# Altium project DesignProject.PrjPCB
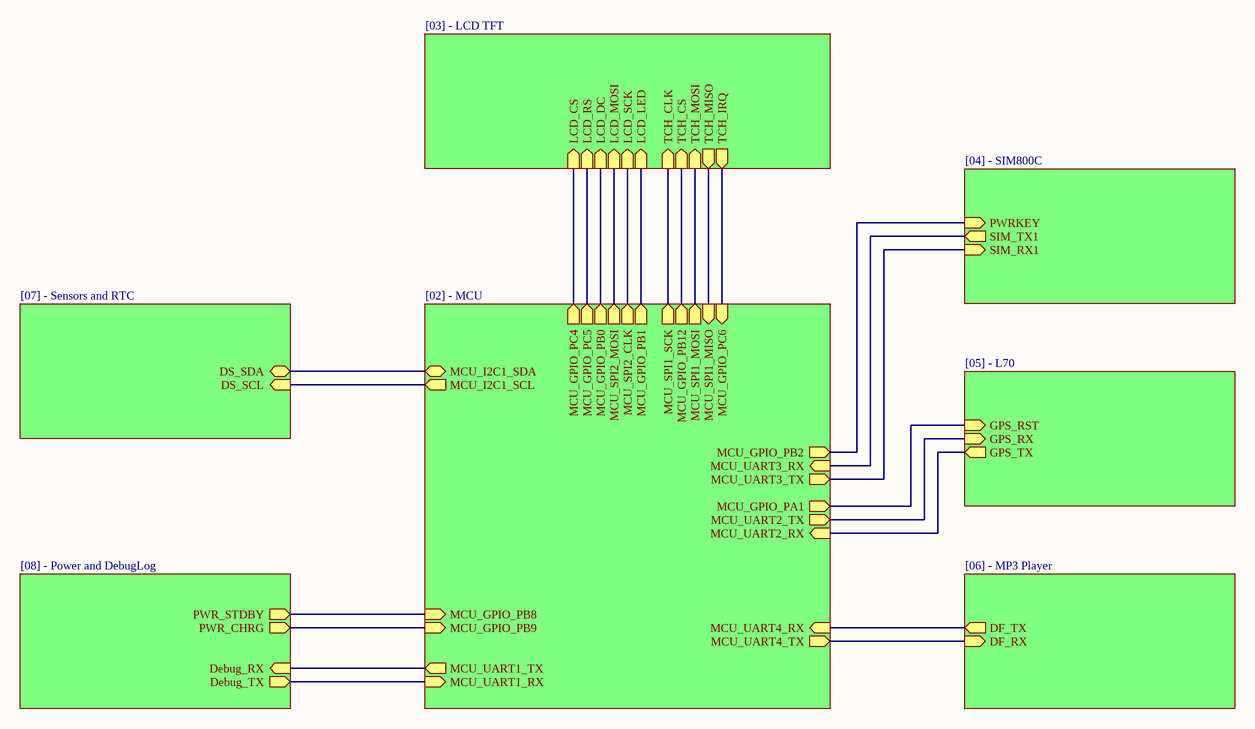
[diagram p0: [01] - Sheet Connection.SchDoc]
6 sheets, 97 parts. Net scope: hierarchical (ports join the sheet entries above them; power ports are global).
Board files: DesignProject.PcbDoc, DesignProject_V1_0.PcbDoc, DesignProject_V1_1.PcbDoc
Sheets:
  [01] - Sheet Connection.SchDoc
    01 = [02] - MCU.SchDoc
    03 = [04] - SIM800C.SchDoc
    04 = [05] - L70.SchDoc
    05 = [06] - MP3 Player.SchDoc
    07 = [08] - Power and DebugLog.SchDoc

## Sheet [01] - Sheet Connection.SchDoc: =ProjectName
size A4; CheckedBy: Ven; Author: Ven; CompanyName: HUST; Revision: V.1.0

### Sub-sheets
01 = [02] - MCU: MCU_UART2_RX (in), MCU_SPI1_SCK (out), MCU_UART1_RX (in), MCU_UART3_TX (out), MCU_SPI2_CLK (out), MCU_I2C1_SDA (bidir), MCU_UART3_RX (in), MCU_GPIO_PB0 (out), MCU_GPIO_PB1 (out), MCU_UART1_TX (out), MCU_GPIO_PC5 (out), MCU_SPI1_MOSI (out), MCU_UART2_TX (out), MCU_GPIO_PC4 (out), MCU_GPIO_PB2 (out), MCU_I2C1_SCL (out), MCU_SPI2_MOSI (out), MCU_SPI1_MISO (in), MCU_UART4_TX (out), MCU_UART4_RX (in), MCU_GPIO_PA1 (out), MCU_GPIO_PB12 (out), MCU_GPIO_PC6 (in), MCU_GPIO_PB8 (in), MCU_GPIO_PB9 (in)
02 = [03] - LCD TFT (file not in this document): LCD_LED (in), TCH_CS (in), LCD_CS (in), TCH_IRQ (out), TCH_MISO (out), LCD_SCK (in), LCD_RS (in), TCH_CLK (in), LCD_DC (in), LCD_MOSI (in), TCH_MOSI (in)
03 = [04] - SIM800C: SIM_TX1 (out), PWRKEY (in), SIM_RX1 (in)
04 = [05] - L70: GPS_RST (in), GPS_RX (in), GPS_TX (out)
05 = [06] - MP3 Player: DF_TX (out), DF_RX (in)
06 = [07] - Sensors and RTC (file not in this document): DS_SDA (bidir), DS_SCL (in)
07 = [08] - Power and DebugLog: Debug_RX (in), Debug_TX (out), PWR_STDBY (out), PWR_CHRG (out)

### Nets
CLK2: sheet 01/MCU_SPI2_CLK, sheet 02/LCD_SCK
GPS_RX1: sheet 01/MCU_UART2_TX, sheet 04/GPS_RX
GPS_TX1: sheet 01/MCU_UART2_RX, sheet 04/GPS_TX
MISO1: sheet 01/MCU_SPI1_MISO, sheet 02/TCH_MISO
MOSI1: sheet 01/MCU_SPI1_MOSI, sheet 02/TCH_MOSI
MOSI2: sheet 01/MCU_SPI2_MOSI, sheet 02/LCD_MOSI
MP3_RX: sheet 01/MCU_UART4_TX, sheet 05/DF_RX
MP3_TX: sheet 01/MCU_UART4_RX, sheet 05/DF_TX
RX1: sheet 01/MCU_UART1_RX, sheet 07/Debug_TX
RX3: sheet 01/MCU_UART3_RX, sheet 03/SIM_TX1
SCK1: sheet 01/MCU_SPI1_SCK, sheet 02/TCH_CLK
SCL1: sheet 01/MCU_I2C1_SCL, sheet 06/DS_SCL
SDA1: sheet 01/MCU_I2C1_SDA, sheet 06/DS_SDA
TX1: sheet 01/MCU_UART1_TX, sheet 07/Debug_RX
TX3: sheet 01/MCU_UART3_TX, sheet 03/SIM_RX1
NetR10_1: sheet 01/MCU_GPIO_PB2, sheet 03/PWRKEY
NetR21_1: sheet 01/MCU_GPIO_PA1, sheet 04/GPS_RST
NetR30_2: sheet 01/MCU_GPIO_PB9, sheet 07/PWR_CHRG
NetR31_2: sheet 01/MCU_GPIO_PB8, sheet 07/PWR_STDBY
NetU1_24: sheet 01/MCU_GPIO_PC4, sheet 02/LCD_CS
NetU1_25: sheet 01/MCU_GPIO_PC5, sheet 02/LCD_RS
NetU1_26: sheet 01/MCU_GPIO_PB0, sheet 02/LCD_DC
NetU1_27: sheet 01/MCU_GPIO_PB1, sheet 02/LCD_LED
NetU1_33: sheet 01/MCU_GPIO_PB12, sheet 02/TCH_CS
NetU1_37: sheet 01/MCU_GPIO_PC6, sheet 02/TCH_IRQ

### Notes on the sheet
- Project:
- Page Contents:
- Size:
- Date:
- A4
- Checked by:
- Time:
- Revision:
- Sheet
- of
- File:

## Sheet [02] - MCU.SchDoc: =ProjectName
size A4; CheckedBy: Ven; Author: Ven; CompanyName: HUST; Revision: V.1.0
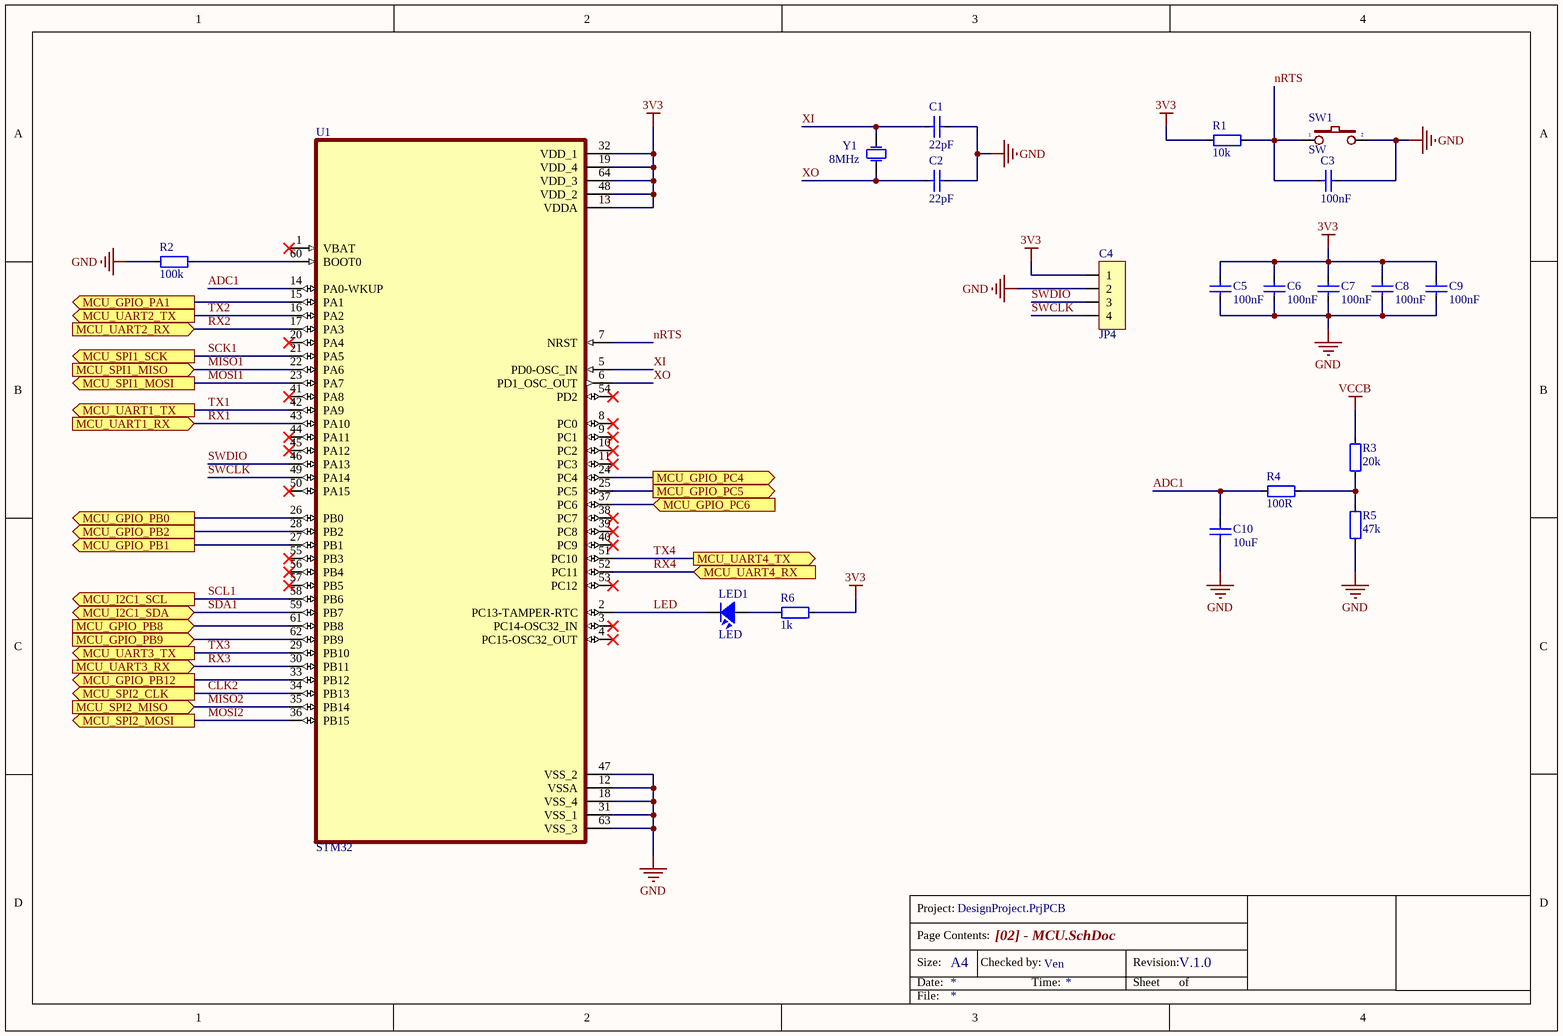
[diagram p1: [02] - MCU.SchDoc]

### Parts
C1  22pF  [CAP_0603]
C2  22pF  [CAP_0603]
C3  100nF  [CAP_0603]
C4  JP4  [JP4-C1T]
C5  100nF  [CAP_0603]
C6  100nF  [CAP_0603]
C7  100nF  [CAP_0603]
C8  100nF  [CAP_0603]
C9  100nF  [CAP_0603]
C10  10uF  [CAP_0603]
LED1  LED  [LED-0805-Red]
R1  10k  [RES-SMD-0603]
R2  100k  [RES-SMD-0603]
R3  20k  [RES-SMD-0603]
R4  100R  [RES-SMD-0603]
R5  47k  [RES-SMD-0603]
R6  1k  [RES-SMD-0603]
SW1  SW  [SW2]
U1  STM32  [QFP50P1200X1200X160-64N]
Y1  8MHz  [XTAL 5032 SMD]

### Ports
MCU_GPIO_PA1 (out), MCU_GPIO_PB0 (out), MCU_GPIO_PB1 (out), MCU_GPIO_PB2 (out), MCU_GPIO_PB8 (in), MCU_GPIO_PB9 (in), MCU_GPIO_PB12 (out), MCU_GPIO_PC4 (out), MCU_GPIO_PC5 (out), MCU_GPIO_PC6 (in), MCU_I2C1_SCL (out), MCU_I2C1_SDA (bidir), MCU_SPI1_MISO (in), MCU_SPI1_MOSI (out), MCU_SPI1_SCK (out), MCU_SPI2_CLK (out), MCU_SPI2_MISO (in), MCU_SPI2_MOSI (out), MCU_UART1_RX (in), MCU_UART1_TX (out), MCU_UART2_RX (in), MCU_UART2_TX (out), MCU_UART3_RX (in), MCU_UART3_TX (out), MCU_UART4_RX (in), MCU_UART4_TX (out)

### Nets
3V3: C4.1 C5.2 C6.2 C7.2 C8.2 C9.2 R1.1 R6.1 U1.13(VDDA) U1.19(VDD_4) U1.32(VDD_1) U1.48(VDD_2) U1.64(VDD_3)
GND: C1.1 C2.1 C3.1 C4.2 C5.1 C6.1 C7.1 C8.1 C9.1 C10.2 R2.1 R5.2 SW1.2 U1.12(VSSA) U1.18(VSS_4) U1.31(VSS_1) U1.47(VSS_2) U1.63(VSS_3)
VCCB: R3.1
ADC1: C10.1 R4.1 U1.14(PA0-WKUP)
CLK2: U1.34(PB13) ; port MCU_SPI2_CLK
LED: LED1.2 U1.2(PC13-TAMPER-RTC)
MISO1: U1.22(PA6) ; port MCU_SPI1_MISO
MISO2: U1.35(PB14) ; port MCU_SPI2_MISO
MOSI1: U1.23(PA7) ; port MCU_SPI1_MOSI
MOSI2: U1.36(PB15) ; port MCU_SPI2_MOSI
nRTS: C3.2 R1.2 SW1.1 U1.7(NRST)
RX1: U1.43(PA10) ; port MCU_UART1_RX
RX2: U1.17(PA3) ; port MCU_UART2_RX  [project net GPS_TX1]
RX3: U1.30(PB11) ; port MCU_UART3_RX
RX4: U1.52(PC11) ; port MCU_UART4_RX  [project net MP3_TX]
SCK1: U1.21(PA5) ; port MCU_SPI1_SCK
SCL1: U1.58(PB6) ; port MCU_I2C1_SCL
SDA1: U1.59(PB7) ; port MCU_I2C1_SDA
SWCLK: C4.4 U1.49(PA14)
SWDIO: C4.3 U1.46(PA13)
TX1: U1.42(PA9) ; port MCU_UART1_TX
TX2: U1.16(PA2) ; port MCU_UART2_TX  [project net GPS_RX1]
TX3: U1.29(PB10) ; port MCU_UART3_TX
TX4: U1.51(PC10) ; port MCU_UART4_TX  [project net MP3_RX]
XI: C1.2 U1.5(PD0-OSC_IN) Y1.2(OSC2)
XO: C2.2 U1.6(PD1_OSC_OUT) Y1.1(OSC1)
NetLED1_1: LED1.1 R6.2
NetR2_2: R2.2 U1.60(BOOT0)
NetR3_2: R3.2 R4.2 R5.1
NetR10_1: U1.28(PB2) ; port MCU_GPIO_PB2
NetR21_1: U1.15(PA1) ; port MCU_GPIO_PA1
NetR30_2: U1.62(PB9) ; port MCU_GPIO_PB9
NetR31_2: U1.61(PB8) ; port MCU_GPIO_PB8
NetU1_24: U1.24(PC4) ; port MCU_GPIO_PC4
NetU1_25: U1.25(PC5) ; port MCU_GPIO_PC5
NetU1_26: U1.26(PB0) ; port MCU_GPIO_PB0
NetU1_27: U1.27(PB1) ; port MCU_GPIO_PB1
NetU1_33: U1.33(PB12) ; port MCU_GPIO_PB12
NetU1_37: U1.37(PC6) ; port MCU_GPIO_PC6

Not connected (* = marked no-connect by the designer): U1 1(VBAT)* 3(PC14-OSC32_IN)* 4(PC15-OSC32_OUT)* 8(PC0)* 9(PC1)* 10(PC2)* 11(PC3)* 20(PA4)* 38(PC7)* 39(PC8)* 40(PC9)* 41(PA8)* 44(PA11)* 45(PA12)* 50(PA15)* 53(PC12)* 54(PD2)* 55(PB3)* 56(PB4)* 57(PB5)*

### Notes on the sheet
- Project:
- Page Contents:
- Size:
- Date:
- A4
- Checked by:
- Time:
- Revision:
- Sheet
- of
- File:

### Library data of the parts
C1-C3 C5-C10 = CapSMD: Capacitor; Value: 33p; Published: 8-Jun-2000; LatestRevisionDate: 17-Jul-2002; LatestRevisionNote: Re-released for DXP Platform.; PackageReference: RAD-0.3; Publisher: Altium Limited
C4 = JP4: WR-PHD 2.54 mm Angled Socket Header; Manufacturer: W¨¹rth Elektronik eiSos GmbH; partNo: 613004143121; ComponentLink1 Description: Manufacturer; ComponentLink2 Description: Datasheet; NoPins: 04; Created Date: 29 March 2013; ComponentLink1URL: http://www.we-online.com; ComponentLink2URL: http://katalog.we-online.de/em/datasheet/6130xx143121.pdf; Created by: Karrer Zheng
LED1 = LED: LED Single colour Green and Red; Value: LED 3 ly Single Colour
R1-R6 = Resistor - SMD: Resistor; Manufacturer: Generic Components; Class: Passive; Published: 08/06/2000; Publisher: Altium Hobart Technology Centre
SW1 = SW2: Switch button 2 pin; Value: SW chip 2 pin
U1 = STM32F103RCT6: STM32 ARM-based 32-bit MCU 72MHz 256KB
Y1 = XTAL: Crystal Oscillator; Published: 8-Jun-2000; LatestRevisionDate: 17-Jul-2002; LatestRevisionNote: Re-released for DXP Platform.; PackageReference: R38; Publisher: Altium Limited

## Sheet [04] - SIM800C.SchDoc: =ProjectName
size A4; CheckedBy: Ven; Author: Ven; CompanyName: HUST; Revision: V.1.0
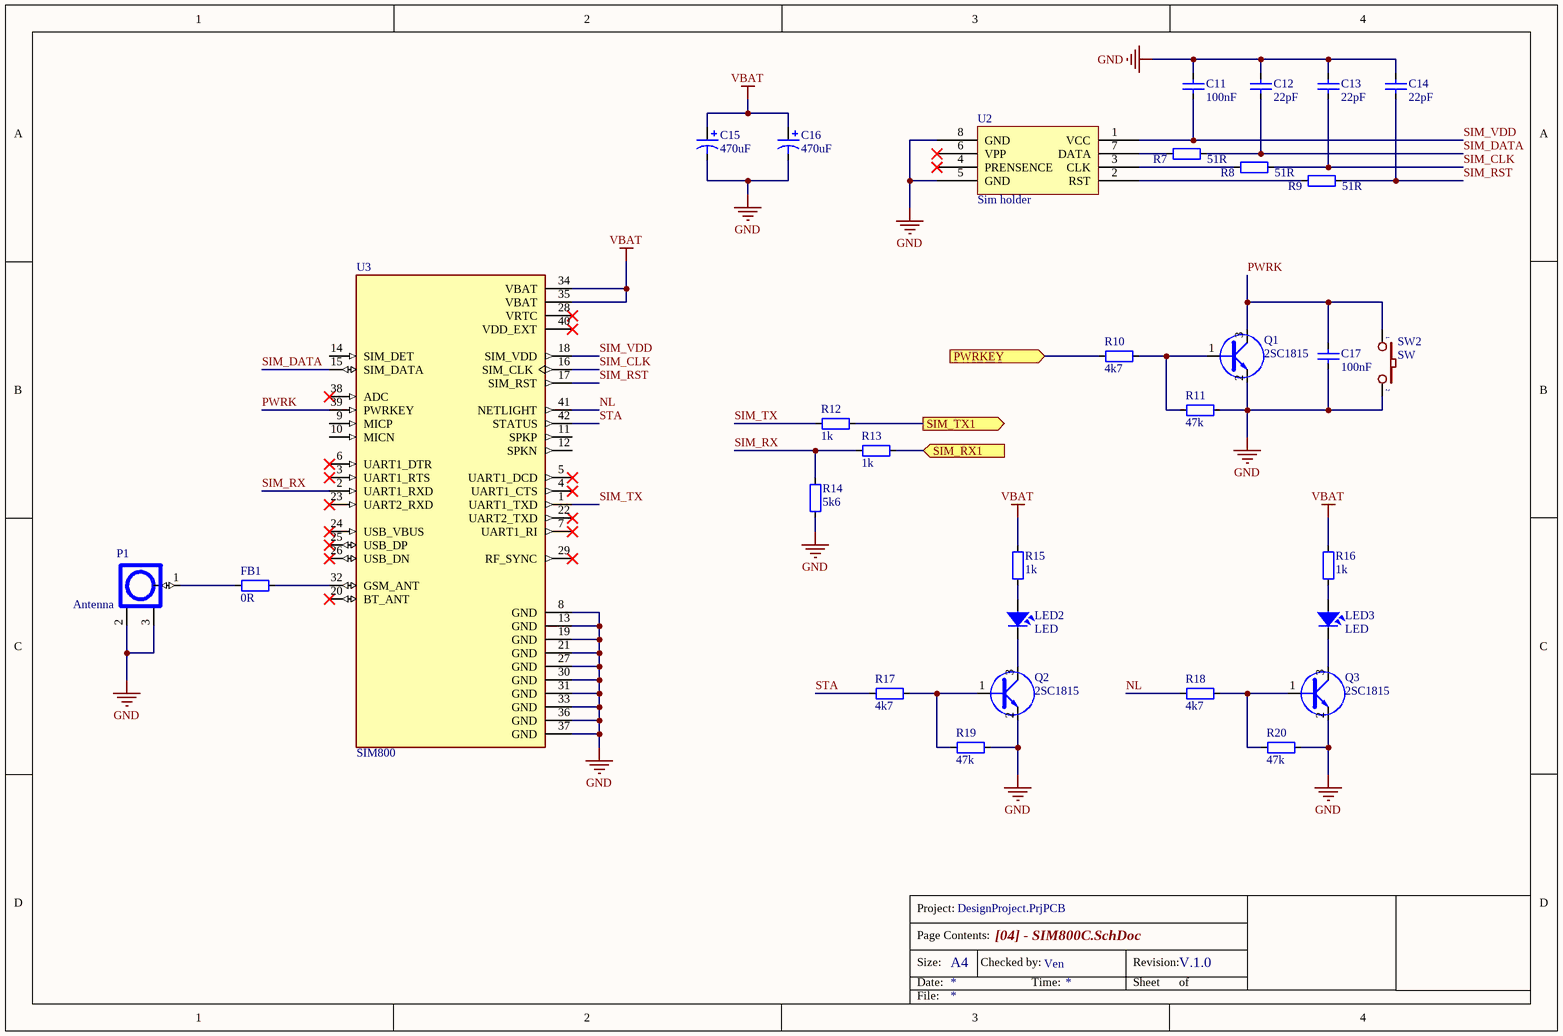
[diagram p2: [04] - SIM800C.SchDoc]

### Parts
C11  100nF  [CAP_0603]
C12  22pF  [CAP_0603]
C13  22pF  [CAP_0603]
C14  22pF  [CAP_0603]
C15  470uF  [CAP_7343]
C16  470uF  [CAP_7343]
C17  100nF  [CAP_0603]
FB1  0R  [RES-SMD-0603]
LED2  LED  [LED-0805-Green]
LED3  LED  [LED-0805-Green]
P1  Antenna  [IPXS]
Q1  2SC1815  [SOT23]
Q2  2SC1815  [SOT23]
Q3  2SC1815  [SOT23]
R7  51R  [RES-SMD-0603]
R8  51R  [RES-SMD-0603]
R9  51R  [RES-SMD-0603]
R10  4k7  [RES-SMD-0603]
R11  47k  [RES-SMD-0603]
R12  1k  [RES-SMD-0603]
R13  1k  [RES-SMD-0603]
R14  5k6  [RES-SMD-0603]
R15  1k  [RES-SMD-0603]
R16  1k  [RES-SMD-0603]
R17  4k7  [RES-SMD-0603]
R18  4k7  [RES-SMD-0603]
R19  47k  [RES-SMD-0603]
R20  47k  [RES-SMD-0603]
SW2  SW  [SW2]
U2  value Sim holder  [Sim Socket]  (hidden comment: SIM-KF016)
U3  SIM800  [SIM800C]

### Ports
PWRKEY (in), SIM_RX1 (in), SIM_TX1 (out)

### Nets
GND: C11.2 C12.2 C13.2 C14.2 C15.2 C16.2 C17.1 P1.2 P1.3 Q1.2(E) Q2.2(E) Q3.2(E) R11.2 R14.1 R19.2 R20.2 SW2.2 U2.5(GND) U2.8(GND) U3.8(GND) U3.13(GND) U3.19(GND) U3.21(GND) U3.27(GND) U3.30(GND) U3.31(GND) U3.33(GND) U3.36(GND) U3.37(GND)
VBAT: C15.1 C16.1 R15.2 R16.2 U3.34(VBAT) U3.35(VBAT)
NL: R18.1 U3.41(NETLIGHT)
PWRK: C17.2 Q1.3(C) SW2.1 U3.39(PWRKEY)
RX3: R12.1 ; port SIM_TX1
SIM_CLK: C13.1 R8.2 U3.16(SIM_CLK)
SIM_DATA: C12.1 R7.2 U3.15(SIM_DATA)
SIM_RST: C14.1 R9.2 U3.17(SIM_RST)
SIM_RX: R13.2 R14.2 U3.2(UART1_RXD)
SIM_TX: R12.2 U3.1(UART1_TXD)
SIM_VDD: C11.1 U2.1(VCC) U3.18(SIM_VDD)
STA: R17.1 U3.42(STATUS)
TX3: R13.1 ; port SIM_RX1
NetFB1_1: FB1.1 P1.1
NetFB1_2: FB1.2 U3.32(GSM_ANT)
NetLED2_1: LED2.1 R15.1
NetLED2_2: LED2.2 Q2.3(C)
NetLED3_1: LED3.1 R16.1
NetLED3_2: LED3.2 Q3.3(C)
NetQ1_1: Q1.1(B) R10.2 R11.1
NetQ2_1: Q2.1(B) R17.2 R19.1
NetQ3_1: Q3.1(B) R18.2 R20.1
NetR7_1: R7.1 U2.7(DATA)
NetR8_1: R8.1 U2.3(CLK)
NetR9_1: R9.1 U2.2(RST)
NetR10_1: R10.1 ; port PWRKEY

Not connected (* = marked no-connect by the designer): U2 4(PRENSENCE)* 6(VPP)*; U3 3(UART1_RTS)* 4(UART1_CTS)* 5(UART1_DCD)* 6(UART1_DTR)* 7(UART1_RI)* 9(MICP) 10(MICN) 11(SPKP) 12(SPKN) 14(SIM_DET) 20(BT_ANT)* 22(UART2_TXD)* 23(UART2_RXD)* 24(USB_VBUS)* 25(USB_DP)* 26(USB_DN)* 28(VRTC)* 29(RF_SYNC)* 38(ADC)* 40(VDD_EXT)*

### Notes on the sheet
- Project:
- Page Contents:
- Size:
- Date:
- A4
- Checked by:
- Time:
- Revision:
- Sheet
- of
- File:

### Library data of the parts
C11-C14 C17 = CapSMD: Capacitor; Value: 33p; Published: 8-Jun-2000; LatestRevisionDate: 17-Jul-2002; LatestRevisionNote: Re-released for DXP Platform.; PackageReference: RAD-0.3; Publisher: Altium Limited
C15 C16 = Cap Pol: Polarized Capacitor (Axial); Published: 8-Jun-2000; LatestRevisionDate: 17-Jul-2002; LatestRevisionNote: Re-released for DXP Platform.; PackageReference: POLAR0.8; Publisher: Altium Limited
FB1 R7-R20 = Resistor - SMD: as R1 on sheet [02] - MCU; Published: 08/06/2000; Publisher: Altium Hobart Technology Centre
LED2 LED3 = LED: as LED1 on sheet [02] - MCU
P1 = IPXSx66: Antenna GSM GPS
Q1-Q3 = 2SC1815: NPN 600mW, ECB; Value: C1815
SW2 = SW2: as SW1 on sheet [02] - MCU
U2 = Sim holder: SIM Card Holder KF-016
U3 = SIM800C: SIM800C IC

## Sheet [05] - L70.SchDoc: =ProjectName
size A4; CheckedBy: Ven; Author: Ven; CompanyName: HUST; Revision: V.1.0
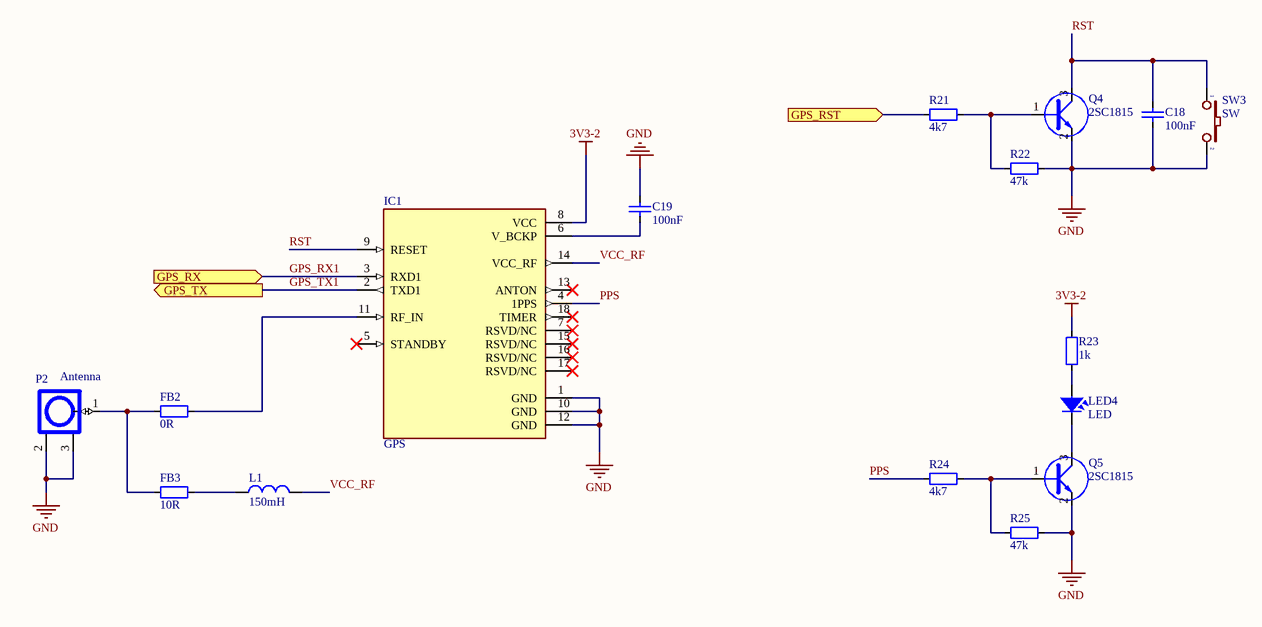
[diagram p3: [05] - L70.SchDoc]

### Parts
C18  100nF  [CAP_0603]
C19  100nF  [CAP_0603]
FB2  0R  [RES-SMD-0603]
FB3  10R  [RES-SMD-0603]
IC1  GPS  [L70]
L1  150mH  [L-0603]
LED4  LED  [LED-0805-Green]
P2  Antenna  [IPXS]
Q4  2SC1815  [SOT23]
Q5  2SC1815  [SOT23]
R21  4k7  [RES-SMD-0603]
R22  47k  [RES-SMD-0603]
R23  1k  [RES-SMD-0603]
R24  4k7  [RES-SMD-0603]
R25  47k  [RES-SMD-0603]
SW3  SW  [SW2]

### Ports
GPS_RST (in), GPS_RX (in), GPS_TX (out)

### Nets
3V3-2: IC1.8(VCC) R23.2
GND: C18.1 C19.1 IC1.1(GND) IC1.10(GND) IC1.12(GND) P2.2 P2.3 Q4.2(E) Q5.2(E) R22.2 R25.2 SW3.2
GPS_RX1: IC1.3(RXD1) ; port GPS_RX
GPS_TX1: IC1.2(TXD1) ; port GPS_TX
PPS: IC1.4(1PPS) R24.1
RST: C18.2 IC1.9(RESET) Q4.3(C) SW3.1
VCC_RF: IC1.14(VCC_RF) L1.2
NetC19_2: C19.2 IC1.6(V_BCKP)
NetFB2_1: FB2.1 FB3.1 P2.1
NetFB2_2: FB2.2 IC1.11(RF_IN)
NetFB3_2: FB3.2 L1.1
NetLED4_1: LED4.1 R23.1
NetLED4_2: LED4.2 Q5.3(C)
NetQ4_1: Q4.1(B) R21.2 R22.1
NetQ5_1: Q5.1(B) R24.2 R25.1
NetR21_1: R21.1 ; port GPS_RST

Not connected (* = marked no-connect by the designer): IC1 5(STANDBY)* 7(RSVD/NC)* 13(ANTON)* 15(RSVD/NC)* 16(RSVD/NC)* 17(RSVD/NC)* 18(TIMER)*

### Notes on the sheet
- Project:
- Page Contents:
- Size:
- Date:
- A4
- Checked by:
- Time:
- Revision:
- Sheet
- of
- File:

### Library data of the parts
C18 C19 = CapSMD: Capacitor; Value: 33p; Published: 8-Jun-2000; LatestRevisionDate: 17-Jul-2002; LatestRevisionNote: Re-released for DXP Platform.; PackageReference: RAD-0.3; Publisher: Altium Limited
FB2 FB3 R21-R25 = Resistor - SMD: as R1 on sheet [02] - MCU; Published: 08/06/2000; Publisher: Altium Hobart Technology Centre
IC1 = L70: Quectel GPS IC
L1 = L1: Inductor; Value: 150 mH
LED4 = LED: as LED1 on sheet [02] - MCU
P2 = IPXSx66: Antenna GSM GPS
Q4 Q5 = 2SC1815: NPN 600mW, ECB; Value: C1815
SW3 = SW2: as SW1 on sheet [02] - MCU

## Sheet [06] - MP3 Player.SchDoc: =ProjectName
size A4; CheckedBy: Ven; Author: Ven; CompanyName: HUST; Revision: V.1.0
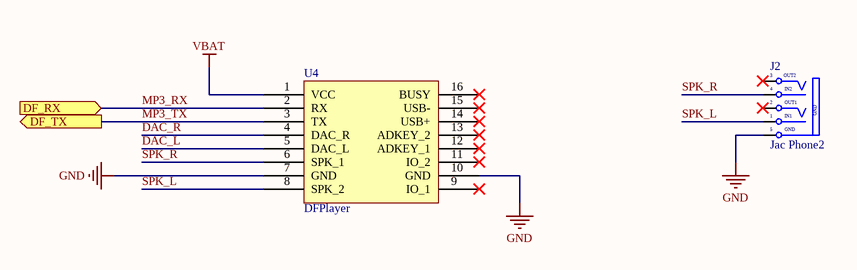
[diagram p4: [06] - MP3 Player.SchDoc]

### Parts
J2  Jac Phone2  [JAC_PHONE2]
U4  DFPlayer  [DFPlayer]

### Ports
DF_RX (in), DF_TX (out)

### Nets
GND: J2.5(GND) U4.7(GND) U4.10(GND)
VBAT: U4.1(VCC)
DAC_L: U4.5(DAC_L)
DAC_R: U4.4(DAC_R)
MP3_RX: U4.2(RX) ; port DF_RX
MP3_TX: U4.3(TX) ; port DF_TX
SPK_L: J2.1(S1) U4.8(SPK_2)
SPK_R: J2.4(S) U4.6(SPK_1)

Not connected (* = marked no-connect by the designer): J2 2(S1)* 3(TN)*; U4 9(IO_1)* 11(IO_2)* 12(ADKEY_1)* 13(ADKEY_2)* 14(USB+)* 15(USB-)* 16(BUSY)*

### Notes on the sheet
- Project:
- Page Contents:
- Size:
- Date:
- A4
- Checked by:
- Time:
- Revision:
- Sheet
- of
- File:
- (in symbol Jac Phone2) OUT2; IN2; OUT1; IN1

### Library data of the parts
J2 = Jac Phone2: Jac Phone Stereo; Creat by: VanDungEvn@Gmail.com

## Sheet [08] - Power and DebugLog.SchDoc: =ProjectName
size A4; CheckedBy: Ven; Author: Ven; CompanyName: HUST; Revision: V.1.0
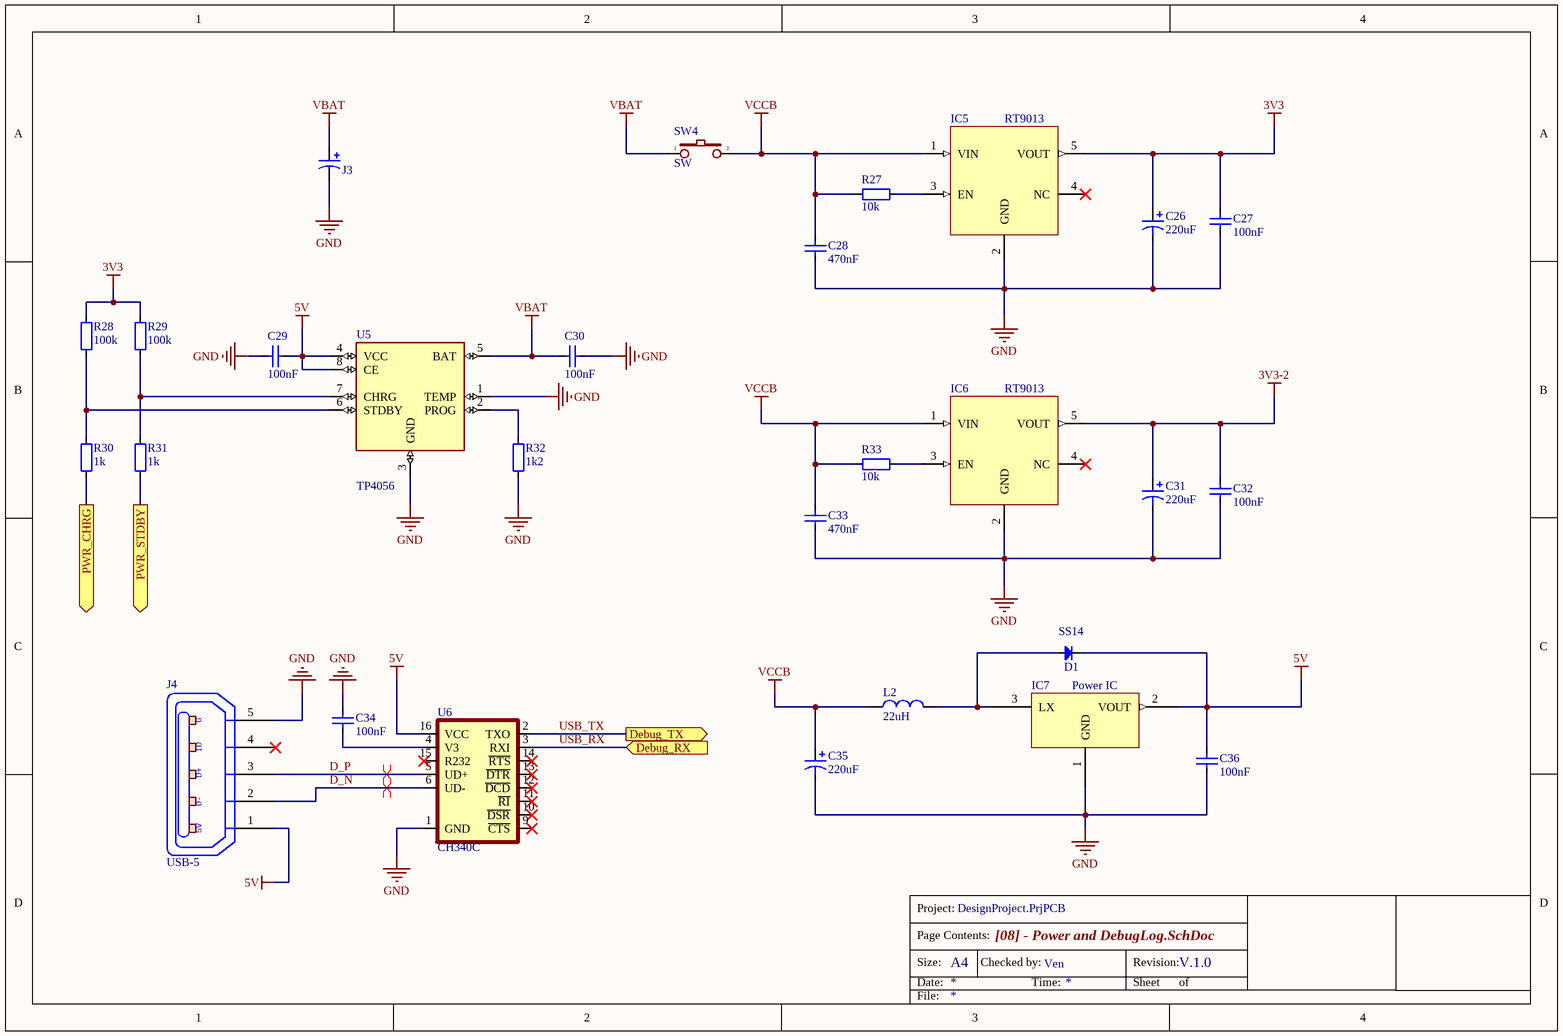
[diagram p5: [08] - Power and DebugLog.SchDoc]

### Parts
C26  220uF  [CAP_TANTALUM_3216]
C27  100nF  [CAP_0603]
C28  470nF  [CAP_0603]
C29  100nF  [CAP_0603]
C30  100nF  [CAP_0603]
C31  220uF  [CAP_TANTALUM_3216]
C32  100nF  [CAP_0603]
C33  470nF  [CAP_0603]
C34  100nF  [CAP_0603]
C35  220uF  [CAP_TANTALUM_3216]
C36  100nF  [CAP_0603]
D1  SS14  [DO-214AC(SMA)]
IC5  RT9013  [SOT23-5]
IC6  RT9013  [SOT23-5]
IC7  Power IC  [SOT-89-3]
J3  CAP_TAN_SMD  [CAP_7343]  (value not drawn)
J4  USB-5  [USB-M1]
L2  22uH  [L-SMD-M-7.3x4.5]
R27  10k  [RES-SMD-0603]
R28  100k  [RES-SMD-0603]
R29  100k  [RES-SMD-0603]
R30  1k  [RES-SMD-0603]
R31  1k  [RES-SMD-0603]
R32  1k2  [RES-SMD-0603]
R33  10k  [RES-SMD-0603]
SW4  SW  [SW2]
U5  TP4056  [TP4056]
U6  CH340C  [SO016]

### Ports
Debug_RX (in), Debug_TX (out), PWR_CHRG (out), PWR_STDBY (out)

### Nets
3V3: C26.1 C27.1 IC5.5(VOUT) R28.1 R29.1
3V3-2: C31.1 C32.1 IC6.5(VOUT)
5V: C29.1 C36.1 D1.2(K) IC7.2(VOUT) J4.1(P1) U5.4(VCC) U5.8(CE) U6.16(VCC)
GND: C26.2 C27.2 C28.2 C29.2 C30.1 C31.2 C32.2 C33.2 C34.1 C35.2 C36.2 IC5.2(GND) IC6.2(GND) IC7.1(GND) J3.2 J4.5(P5) R32.1 U5.1(TEMP) U5.3(GND) U6.1(GND)
VBAT: C30.2 J3.1 SW4.1 U5.5(BAT)
VCCB: C28.1 C33.1 C35.1 IC5.1(VIN) IC6.1(VIN) L2.1 R27.2 R33.2 SW4.2
D_N: J4.2(P2) U6.6(UD-)
D_P: J4.3(P3) U6.5(UD+)
USB_RX: U6.3(RXI) ; port Debug_RX  [project net TX1]
USB_TX: U6.2(TXO) ; port Debug_TX  [project net RX1]
NetC34_2: C34.2 U6.4(V3)
NetD1_1: D1.1(A) IC7.3(LX) L2.2
NetIC5_3: IC5.3(EN) R27.1
NetIC6_3: IC6.3(EN) R33.1
NetR28_2: R28.2 R30.1 U5.6(STDBY)
NetR29_2: R29.2 R31.1 U5.7(CHRG)
NetR30_2: R30.2 ; port PWR_CHRG
NetR31_2: R31.2 ; port PWR_STDBY
NetR32_2: R32.2 U5.2(PROG)

Not connected (* = marked no-connect by the designer): IC5 4(NC)*; IC6 4(NC)*; J4 4(P4)*; U6 9(~{CTS})* 10(~{DSR})* 11(~{RI})* 12(~{DCD})* 13(~{DTR})* 14(~{RTS})* 15(R232)*

### Layout directives
differential pair: D_N, D_P

### Notes on the sheet
- Project:
- Page Contents:
- Size:
- Date:
- A4
- Checked by:
- Time:
- Revision:
- Sheet
- of
- File:
- (in symbol USB-5) G; ID; D+; D-; 5V

### Library data of the parts
C26 C31 C35 = Cap Pol: Polarized Capacitor (Axial); Published: 8-Jun-2000; LatestRevisionDate: 17-Jul-2002; LatestRevisionNote: Re-released for DXP Platform.; PackageReference: POLAR0.8; Publisher: Altium Limited
C27-C30 C32-C34 C36 = CapSMD: Capacitor; Value: 33p; Published: 8-Jun-2000; LatestRevisionDate: 17-Jul-2002; LatestRevisionNote: Re-released for DXP Platform.; PackageReference: RAD-0.3; Publisher: Altium Limited
D1 = Diode SMD: Code - JEDEC: DO-214-AB; Value: 1N5007; Published: 8-Jun-2000; Revision: July-2002: Re-released for DXP Platform.; Publisher: Altium Limited
IC5 IC6 = RT9013: RT9013-33GB IC REG LINEAR 3.3V 500mA SOT23-5
IC7 = CE8301A: Boost 5V IC 500mA
J3 = CAP_TAN_SMD: Polazied Tantalum Capacitor
J4 = USB-5: Manufacturer: FCI; Manufacturer Part Number: 10118193-0001LF; Connector Type: USB - micro B; Number of Contacts: 5; Gender: Receptacle; Specifications: USB 2.0; .Creator: MM; .Checked PCB: RF; Supplier 1: Digi-Key; RoHS: RoHS Compliant; Category: Connectors, Interconnects; Stock 1: 28642; Pricing 1: 1=0.46, 10=0.433, 25=0.3712, 50=0.3156, 100=0.3032, 250=0.27224, 500=0.25988 (USD); Packaging: Cut Tape (CT); Mounting Type: Surface Mount, Right Angle, Horizontal; Features: Shielded, Solder Retention; Ingress Protection: -; ComponentLink1URL: http://portal.fciconnect.com/Comergent//fci/drawing/10118193.pdf; ComponentLink1Description: http://portal.fciconnect.com/Comergent//fci/drawing/10118193.pdf; Supplier Part Number 1: 609-4616-1-ND; .Checked SCH: MM
L2 = L1: Inductor; Value: 150 mH
R27-R33 = Resistor - SMD: as R1 on sheet [02] - MCU; Published: 08/06/2000; Publisher: Altium Hobart Technology Centre
SW4 = SW2: as SW1 on sheet [02] - MCU
U5 = TP4056: Complete single cell Li-Ion battery with a constant current / constant voltage linear charger
U6 = CH340C: USB to serial chip CH340; MF: WCH; Package: Package; Check_prices: https://www.snapeda.com/parts/CH340C/WCH/view-part/5428851/?ref=eda; Value: *; Price: None; MP: CH340C; Availability: Unavailable; SnapEDA_Link: https://www.snapeda.com/parts/CH340C/WCH/view-part/5428851/?ref=snap

## Nets that join several sheets
3V3: [02] - MCU (13 pins), [08] - Power and DebugLog (5 pins)
3V3-2: [05] - L70 (IC1.8 R23.2), [08] - Power and DebugLog (C31.1 C32.1 IC6.5)
GND: [02] - MCU (18 pins), [04] - SIM800C (29 pins), [05] - L70 (12 pins), [06] - MP3 Player (J2.5 U4.7 U4.10), [08] - Power and DebugLog (20 pins)
VBAT: [04] - SIM800C (6 pins), [06] - MP3 Player (U4.1), [08] - Power and DebugLog (C30.2 J3.1 SW4.1 U5.5)
VCCB: [02] - MCU (R3.1), [08] - Power and DebugLog (9 pins)
GPS_RX1: [02] - MCU (U1.16), [05] - L70 (IC1.3)
GPS_TX1: [02] - MCU (U1.17), [05] - L70 (IC1.2)
MP3_RX: [02] - MCU (U1.51), [06] - MP3 Player (U4.2)
MP3_TX: [02] - MCU (U1.52), [06] - MP3 Player (U4.3)
NetR10_1: [02] - MCU (U1.28), [04] - SIM800C (R10.1)
NetR21_1: [02] - MCU (U1.15), [05] - L70 (R21.1)
NetR30_2: [02] - MCU (U1.62), [08] - Power and DebugLog (R30.2)
NetR31_2: [02] - MCU (U1.61), [08] - Power and DebugLog (R31.2)
RX1: [02] - MCU (U1.43), [08] - Power and DebugLog (U6.2)
RX3: [02] - MCU (U1.30), [04] - SIM800C (R12.1)
TX1: [02] - MCU (U1.42), [08] - Power and DebugLog (U6.3)
TX3: [02] - MCU (U1.29), [04] - SIM800C (R13.1)